# EAGLE design receiver (EAGLE 8.0.0)
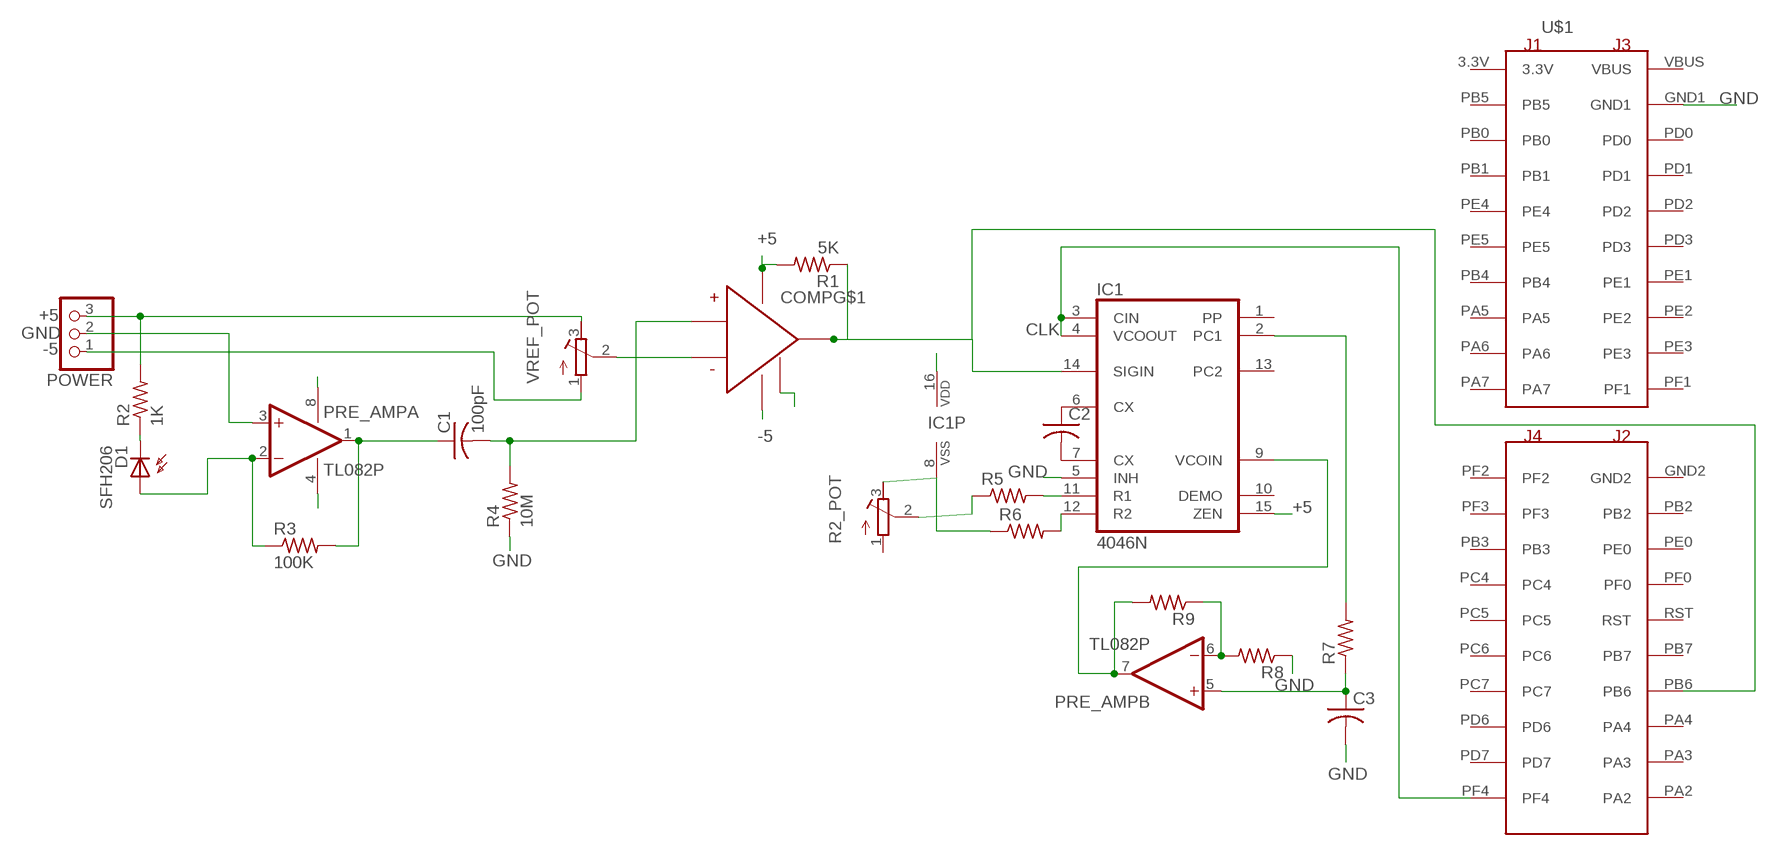
[diagram p0: schematic, sheet 1]

## Parts
C1  100pF  C-US050-025X075  [C050-025X075]
C2  C-US050-025X075  [C050-025X075]
C3  C-US050-025X075  [C050-025X075]
COMP  LM319  [DIL14-1]
D1  SFH206  [SFH206]
IC1  4046N  [DIL16]
POWER  PINHD-1X3  [1X03]
PRE_AMP  TL082P  [DIL08]
R1  5K  R-US_0207/10  [0207/10]
R2  1K  R-US_0207/10  [0207/10]
R2_POT  R-TRIMM3296Y  [RTRIM3296Y]
R3  100K  R-US_0207/10  [0207/10]
R4  10M  R-US_0207/10  [0207/10]
R5  R-US_0207/10  [0207/10]
R6  R-US_0207/10  [0207/10]
R7  R-US_0207/10  [0207/10]
R8  R-US_0207/10  [0207/10]
R9  R-US_0207/10  [0207/10]
U$1  STELLARIS_LAUNCHPAD_BLIZZARD_XL_HEADERS  [STELLARISLAUNCHPADHEADERS]
VREF_POT  R-TRIMM3296Y  [RTRIM3296Y]

## Nets
+5: COMP.P11(VCC) IC1.15(ZEN) IC1.16(VDD) POWER.3 PRE_AMP.8(P:V+) R1.2 R2.2 VREF_POT.3(E)
-5: COMP.P6(GND) POWER.1 PRE_AMP.4(P:V-) VREF_POT.1(A)
A: D1.A PRE_AMP.2(A:-IN) R3.1
AMP_OUT: C1.1 PRE_AMP.1(A:OUT) R3.2
CLK: IC1.3(CIN) IC1.4(VCOOUT) U$1.PF4
DATA_OUT: COMP.P12(OUT) IC1.14(SIGIN) R1.1 U$1.PB6
FILTER_OUT: C1.2 COMP.P4(NONINV) R4.2
GND: C3.2 COMP.P3(GND2) IC1.5(INH) IC1.8(VSS) POWER.2 PRE_AMP.3(A:+IN) R2_POT.3(E) R4.1 R6.1 R8.1 U$1.GND1
N$1: R2_POT.2(S) R5.1
N$2: IC1.11(R1) R5.2
N$3: IC1.12(R2) R6.2
N$4: C2.1 IC1.6(CX)
N$5: D1.K(C) R2.1
N$6: C2.2 IC1.7(CX)
N$7: IC1.9(VCOIN) PRE_AMP.7(B:OUT) R9.2
N$8: C3.1 PRE_AMP.5(B:+IN) R7.1
N$9: IC1.2(PC1) R7.2
N$10: PRE_AMP.6(B:-IN) R8.2 R9.1
THRESH: COMP.P5(INV) VREF_POT.2(S)
Unconnected: COMP.P2(GND) COMP.P7(OUT) COMP.P8(GND2) COMP.P9(NONINV) COMP.P10(INV) COMP.P13(VCC) IC1.1(PP) IC1.10(DEMO) IC1.13(PC2) R2_POT.1(A) U$1.PA2 U$1.PA3 U$1.PA4 U$1.PA5 U$1.PA6 U$1.PA7 U$1.PB0 U$1.PB1 U$1.PB2 U$1.PB3 U$1.PB4 U$1.PB5 U$1.PB7 U$1.PC4 U$1.PC5 U$1.PC6 U$1.PC7 U$1.PD0 U$1.PD1 U$1.PD2 U$1.PD3 U$1.PD6 U$1.PD7 U$1.PE0 U$1.PE1 U$1.PE2 U$1.PE3 U$1.PE4 U$1.PE5 U$1.PF0 U$1.PF1 U$1.PF2 U$1.PF3

## Power pins joined to a net without a drawn wire
3.3V: U$1.3.3V
GND2: U$1.GND2
RST: U$1.RST
VBUS: U$1.VBUS

## Library data of the parts
C1-C3 = rcl:C-US: CAPACITOR, American symbol
COMP = jfw-pwm1:LM319
D1 = opto-trans-siemens:SFH206: PHOTO DIODE; MPN: SFH206K; OC_FARNELL: 1212741; OC_NEWARK: 01M8807
IC1 = 40xx:4046: Micropower PLL
POWER = pinhead:PINHD-1X3: PIN HEADER
PRE_AMP = linear:TL082: OP AMP Data sheet <http://www.ti.com/lit/ds/symlink/tl084a . pdf>; DATA_SHEET: <a href="http://www.ti.com/lit/ds/symlink/tl084a.pdf"> Data sheet </a>
R1 R5-R9 = resistor:R-US_: RESISTOR, American symbol
R2-R4 = rcl:R-US_: RESISTOR, American symbol
R2_POT VREF_POT = rcl:R-TRIMM: Trimm resistor
U$1 = AustinBlackstoneEngineeringPublic:STELLARIS_LAUNCHPAD_BLIZZARD_XL_HEADERS: Headers for Blizzard Chipline Stellaris Launchpad XL Booster Packs. Compatible with the EK-LM4F120XL and EK-TM4C123GXL Launchpads. This header can be used to set the headers correctly spaced. The rest of the board should be based around these headers headers that fit these can be ordered from Samtec.com Part Number SSW-110-23-S-D

## Board
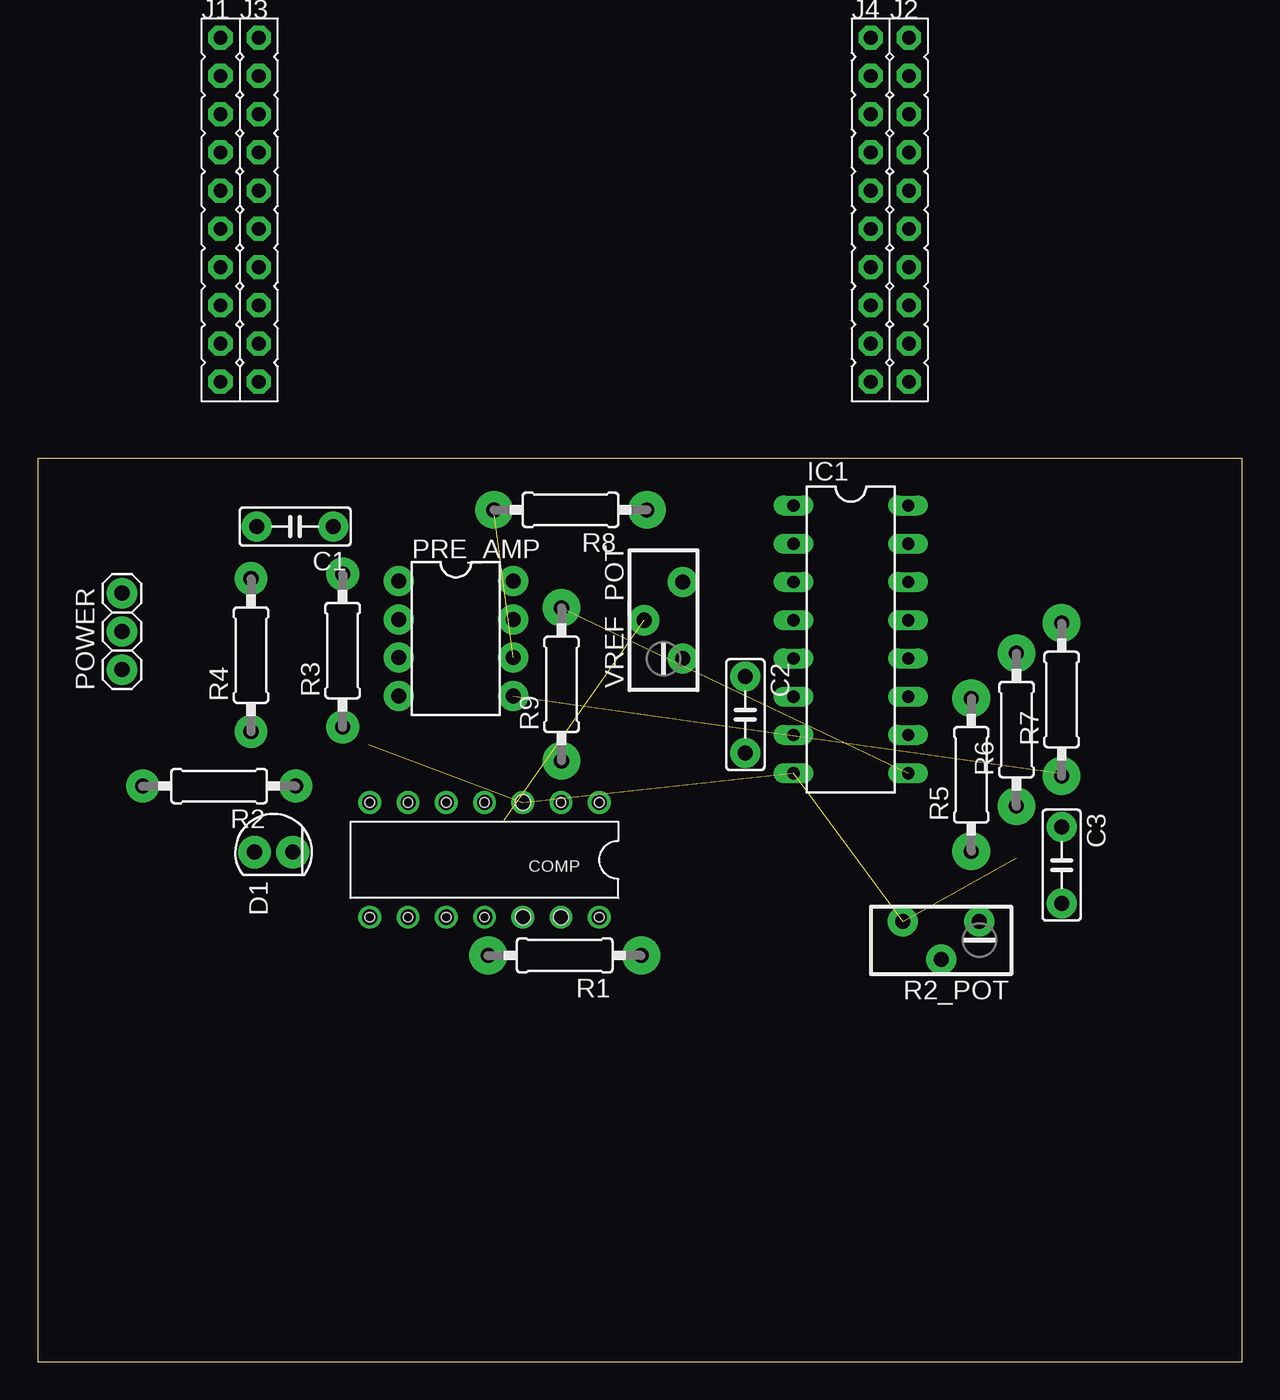
[diagram p1: board, top side]
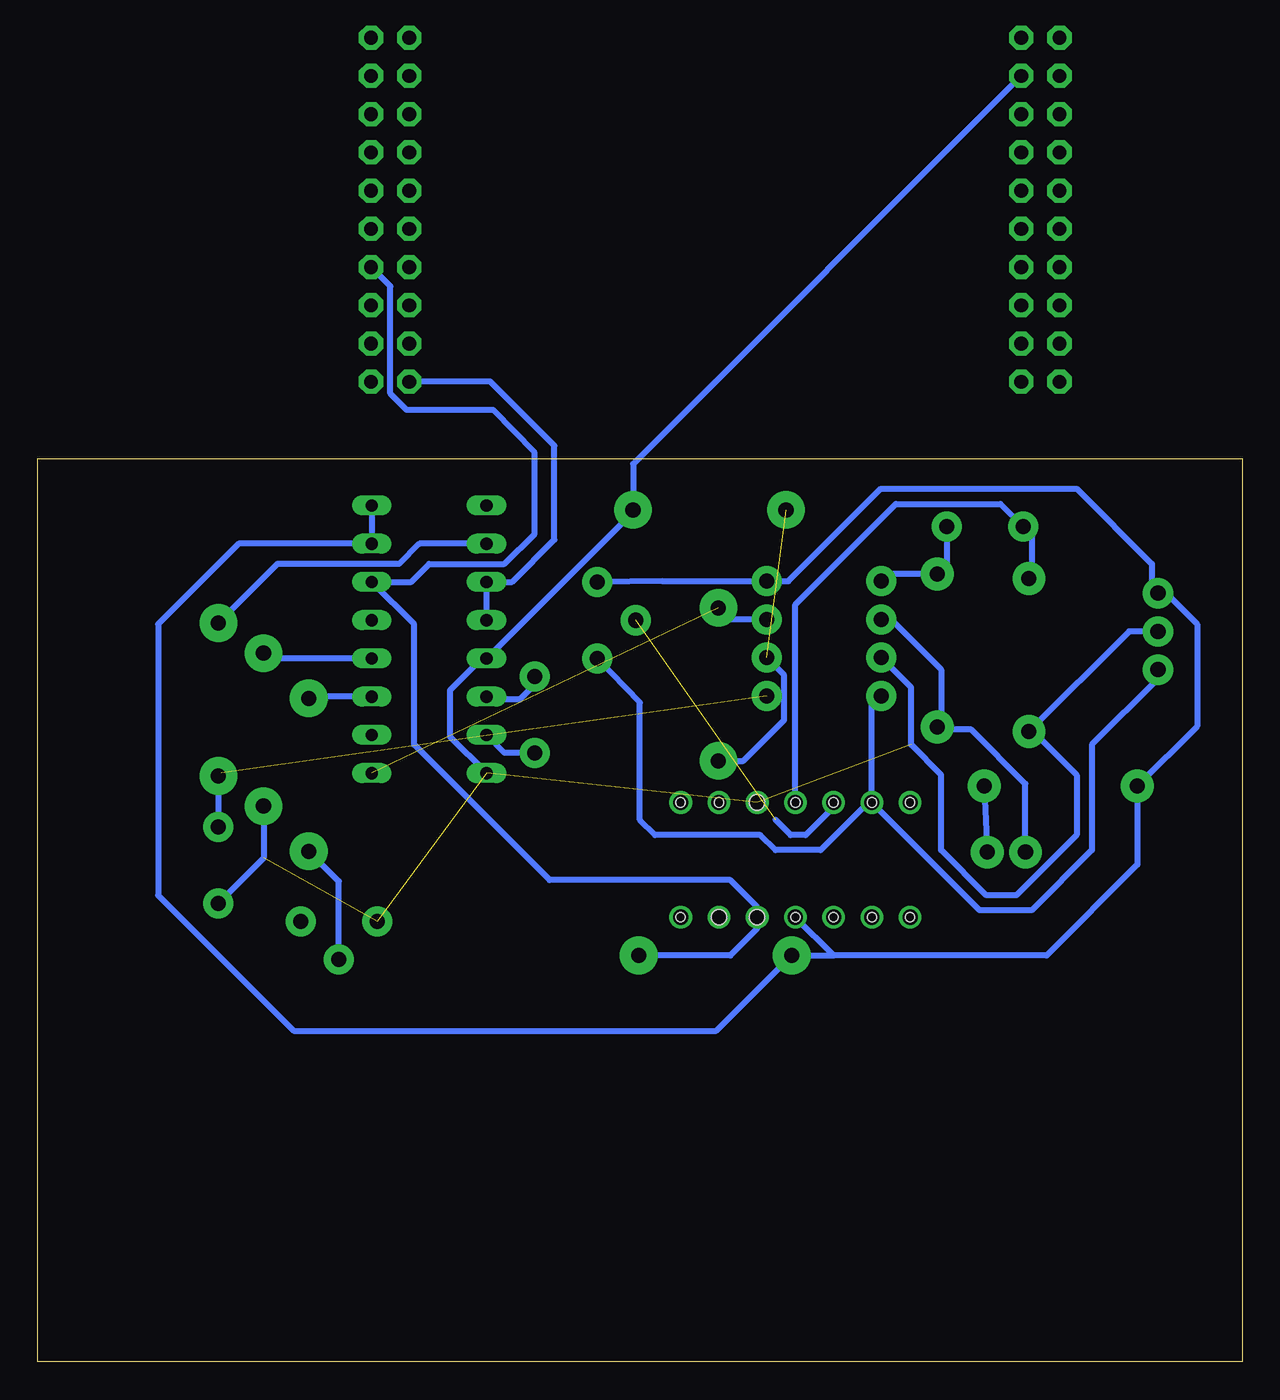
[diagram p2: board, bottom side, seen from below]

Size 80 x 60 mm. Coordinates in mm from the lower left corner, seen from the top.
Outline: 0,0 80,0 80,60 0,60 0,0
Copper layers (1*16): Top 0.035mm / dielectric 1.5mm / Bottom 0.035mm
Design rules "default": minimum track width 10mil, minimum drill 24mil, track to track 8mil, track to pad 8mil, pad to pad 8mil, via to via 8mil, smd to smd 8mil, copper to edge 40mil, drill to drill 8mil, minimum pad ring 10mil, minimum via ring 8mil, stop-mask expansion 4mil, vias tented up to drill 0mil, thermal gap 10mil

### Footprints (pad centres in the part's own frame; a part is rotated, then mirrored left to right if it is on the bottom)
C050-025X075 = drill 1 pad 2: 1 -2.54,0; 2 2.54,0
DIL14-1 = drill 1 pad 1.5: P1 -8.89,-3.81; P2 -6.35,-3.81; P3 -3.81,-3.81; P4 -1.27,-3.81; P5 1.27,-3.81; P6 3.81,-3.81; P7 6.35,-3.81; P8 6.35,3.81; P9 3.81,3.81; P10 1.27,3.81; P11 -1.27,3.81; P12 -3.81,3.81; P13 -6.35,3.81; P14 -8.89,3.81 | hole 0.61: -8.89,-3.81; -6.35,-3.81; -1.27,-3.81; 1.27,-3.81; 3.81,-3.81; 6.35,-3.81; 6.35,3.81; 3.81,3.81; 1.27,3.81; -1.27,3.81; -8.89,3.81 | hole 1: -3.81,-3.81; -3.81,3.81; -6.35,3.81
SFH206 = drill 1 pad 2.184: A 0,-1.27; K 0,1.27
DIL16 = drill 0.813 long: 1 -8.89,-3.81; 2 -6.35,-3.81; 3 -3.81,-3.81; 4 -1.27,-3.81; 5 1.27,-3.81; 6 3.81,-3.81; 7 6.35,-3.81; 8 8.89,-3.81; 9 8.89,3.81; 10 6.35,3.81; 11 3.81,3.81; 12 1.27,3.81; 13 -1.27,3.81; 14 -3.81,3.81; 15 -6.35,3.81; 16 -8.89,3.81
1X03 = drill 1 pad 2: 1 -2.54,0; 2 0,0; 3 2.54,0
DIL08 = drill 1 pad 2: 1 -3.81,-3.81; 2 -1.27,-3.81; 3 1.27,-3.81; 4 3.81,-3.81; 5 3.81,3.81; 6 1.27,3.81; 7 -1.27,3.81; 8 -3.81,3.81
0207/10 = drill 1 pad 2.5: 1 -5.08,0; 2 5.08,0
0207/10' = drill 1 pad 2.184: 1 -5.08,0; 2 5.08,0
RTRIM3296Y = drill 1 pad 2: 1 1.27,-2.54; 2 -1.27,0; 3 1.27,2.54
STELLARISLAUNCHPADHEADERS = drill 0.914 pad 1.6 octagon: 3.3V -22.86,13.97; GND1 -20.32,11.43; GND2 22.86,13.97; PA2 22.86,-8.89; PA3 22.86,-6.35; PA4 22.86,-3.81; PA5 -22.86,-3.81; PA6 -22.86,-6.35; PA7 -22.86,-8.89; PB0 -22.86,8.89; PB1 -22.86,6.35; PB2 22.86,11.43; PB3 20.32,8.89; PB4 -22.86,-1.27; PB5 -22.86,11.43; PB6 22.86,-1.27; PB7 22.86,1.27; PC4 20.32,6.35; PC5 20.32,3.81; PC6 20.32,1.27; PC7 20.32,-1.27; PD0 -20.32,8.89; PD1 -20.32,6.35; PD2 -20.32,3.81; PD3 -20.32,1.27; PD6 20.32,-3.81; PD7 20.32,-6.35; PE0 22.86,8.89; PE1 -20.32,-1.27; PE2 -20.32,-3.81; PE3 -20.32,-6.35; PE4 -22.86,3.81; PE5 -22.86,1.27; PF0 22.86,6.35; PF1 -20.32,-8.89; PF2 20.32,13.97; PF3 20.32,11.43; PF4 20.32,-8.89; RST 22.86,3.81; VBUS -20.32,13.97

### Placement (x,y rotation side)
C1  17.1,55.49 180 top
C2  47,43 270 top
C3  68,33 270 top
COMP  28.41,33.35 180 top
D1  15.67,33.86 270 top
IC1  54,48 270 top
POWER  5.6,48.52 90 top
PRE_AMP  27.78,48.05 270 top
R1  35,27 180 top
R2  1K  [0207/10']  12.05,38.25 180 top
R2_POT  60,28 90 top
R3  100K  [0207/10']  20.25,47.25 90 top
R4  10M  [0207/10']  14.17,46.95 90 top
R5  62,39 90 top
R6  65,42 90 top
R7  68,44 90 top
R8  35.38,56.6 180 top
R9  34.79,45.01 90 top
U$1  35,74 0 top  (outside the outline)
VREF_POT  41.56,49.27 0 top

### Tracks (layer width: path | path; a pad name or v marks a point on that pad's centre or on a via)
+5
  Bottom 0.406: VREF_POT.3 38.52,51.86 PRE_AMP.8 30.14,51.86 24,58 11,58 6,53 6,51.46 POWER.3 5.06,51.06 3,49 3,42.22 R2.2 6.97,33.03 13,27 27.14,27 | 27.14,27 COMP.P11 | 27.14,27 R1.2 34.92,22 63,22 72,31 72,49 66.65,54.35 IC1.15 IC1.16
-5
  Bottom 0.406: POWER.1 5.6,45.4 10,41 10,34 14,30 17.44,30 COMP.P6 | COMP.P6 24.6,43.61 PRE_AMP.4 | COMP.P6 24.84,37.16 28,34 31,34 32,35 39,35 40,36 40,43.79 VREF_POT.1
A
  Bottom 0.406: PRE_AMP.2 23.32,49.32 20,46 20,42.42 R3.1 20.08,42 18,42 14.4,38.4 D1.A
AMP_OUT
  Bottom 0.406: C1.1 19.64,52.94 R3.2 23.5,52.33 PRE_AMP.1
CLK
  Bottom 0.406: IC1.4 IC1.3 48.49,51.81 45.69,54.62 45.69,60.86 49.95,65.12 U$1.PF4
DATA_OUT
  Bottom 0.406: R1.1 34,27 32.22,28.78 COMP.P12 32.22,30.22 34,32 46,32 55,41 55,49 IC1.14 55.19,51.81 54,53 49,53 47,55 47,60.39 49.75,63.24 55.49,63.24 56.58,64.33 56.58,71.45 U$1.PB6
FILTER_OUT
  Bottom 0.406: R4.2 14,52.2 14,55 14.49,55.49 C1.2 16.07,57 23,57 29.68,50.32 COMP.P4
GND  (4 unrouted)
  Bottom 0.406: POWER.2 7.52,48.52 R4.1 13.87,41.87 11,39 11,35 15,31 17,31 20,34 20,39 22,41 22,44.81 PRE_AMP.3 | R6.1 65,33.46 C3.2 | U$1.GND1 40.46,59.65 R8.1 40.46,56.46 IC1.5 50.5,46.73 52.62,44.61 52.62,41.54 IC1.8
N$1
  Bottom 0.406: R2_POT.2 60,31.92 R5.1
N$2
  Bottom 0.406: IC1.11 61.89,44.19 R5.2
N$3
  Bottom 0.406: IC1.12 64.65,46.73 R6.2
N$4
  Bottom 0.406: C2.1 47,45 48,44 50,44 IC1.6
N$5
  Bottom 0.406: R2.1 17.13,38.05 D1.K
N$6
  Bottom 0.406: C2.2 49,40.46 IC1.7
N$7  (1 unrouted)
  Bottom 0.406: PRE_AMP.7 34.02,49.32 R9.2
N$8  (1 unrouted)
  Bottom 0.406: C3.1 R7.1 67.81,39.11
N$9
  Bottom 0.406: IC1.2 54.65,54.35 56,53 64.08,53 R7.2
N$10  (1 unrouted)
  Bottom 0.406: R9.1 33.13,39.93 30.43,42.63 30.43,45.62 PRE_AMP.6
THRESH  (1 unrouted)
  Bottom 0.406: COMP.P5 27.14,36.86 29,35 30,35 31,36